# Altium project PCB_Project.PrjPcb
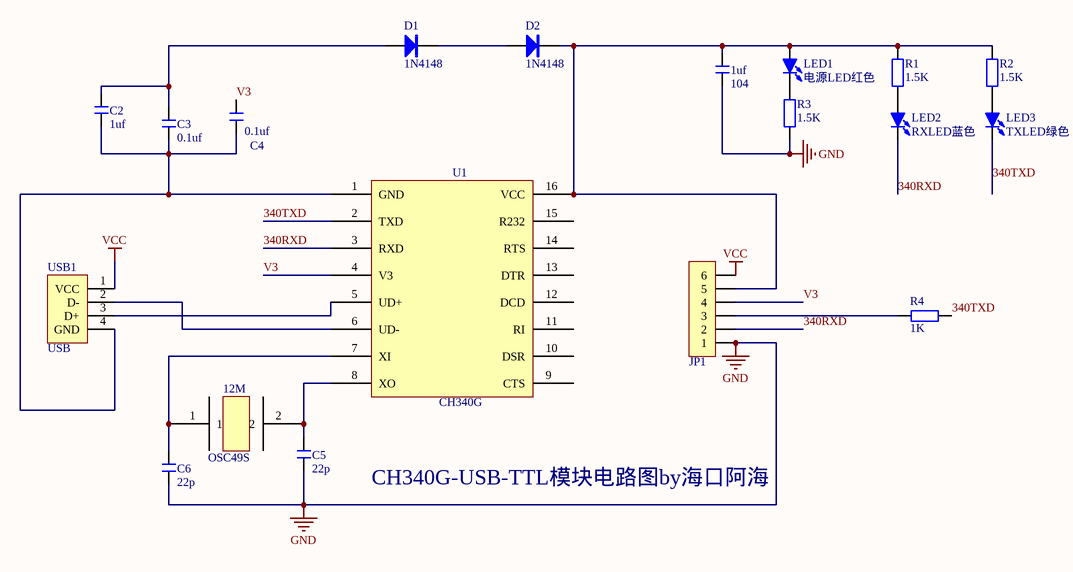
[diagram p0: Sheet1.SchDoc]
1 sheet, 19 parts. Net scope: global (net labels, ports and power ports of the same name join across sheets).
Board file: PCB1.PcbDoc

## Sheet Sheet1.SchDoc
size A4; SheetNumber: 1; SheetTotal: 1

### Parts
1uf  104  [C 0603_L]
12M  OSC49S  [OSC HC-49S]
C2  1uf  [C 0603_L]
C3  0.1uf  [C 0603_L]
C4  0.1uf  [C 0603_L]
C5  22p  [C 0603_L]
C6  22p  [C 0603_L]
D1  1N4148  [MINI_MELF (LL34)]
D2  1N4148  [MINI_MELF (LL34)]
JP1  HDR-1X6  [HDR2.54-LI-6P]  (value not drawn)
LED1  电源LED红色  [LED 0603R]
LED2  RXLED蓝色  [LED 0603B]
LED3  TXLED绿色  [LED 0603G]
R1  1.5K  [R 0603_L]
R2  1.5K  [R 0603_L]
R3  1.5K  [R 0603_L]
R4  1K  [R 0603_L]
U1  CH340G  [SOP16]
USB1  USB  [USB_A/P_A]

### Nets
GND: 1uf.2 C5.1 C6.1 JP1.1 R3.1
VCC: JP1.6 USB1.1(VCC)
340RXD: JP1.2 LED2.2(K) U1.3(RXD)
340TXD: LED3.2(K) R4.2 U1.2(TXD)
V3: C4.2 JP1.4 U1.4(V3)
Net1uf_1: 1uf.1 D2.2(K) JP1.5 LED1.1(A) R1.2 R2.2 U1.16(VCC)
Net12M_1: 12M.1 C6.2 U1.7(XI)
Net12M_2: 12M.2 C5.2 U1.8(XO)
NetC2_1: C2.1 C3.1 C4.1 U1.1(GND) USB1.4(GND)
NetC2_2: C2.2 C3.2 D1.1(A)
NetD1_2: D1.2(K) D2.1(A)
NetJP1_3: JP1.3 R4.1
NetLED1_2: LED1.2(K) R3.2
NetLED2_1: LED2.1(A) R1.1
NetLED3_1: LED3.1(A) R2.1
NetU1_5: U1.5(UD+) USB1.3(D+)
NetU1_6: U1.6(UD-) USB1.2(D-)

Not connected (* = marked no-connect by the designer): U1 9(CTS) 10(DSR) 11(RI) 12(DCD) 13(DTR) 14(RTS) 15(R232)

### Notes on the sheet
- CH340G-USB-TTL模块电路图by海口阿海

### Library data of the parts
1uf C2-C6 = C: 贴片电容; BOM名称: 无极性贴片电容; 淘宝ID: 封装库来自淘宝 ID：黄晶宝石; 联系售后，技术支持: https://shop463601444.taobao.com; 唯一出售店铺网址: https://shop463601444.taobao.com
12M = OSC49S: 晶振49S
D1 D2 = 1N4148: 开关二极管; BOM名称: 高速开关二极管; 淘宝ID: 封装库来自淘宝 ID：黄晶宝石; 欢迎光临: https://shop463601444.taobao.com
JP1 = Header 6: 6P接插件; 版权归属: 封装库来自淘宝 ID：黄晶宝石; BOM名称: 6P接插件; 学习资源: https://shop463601444.taobao.com
LED1-LED3 = LED-SMD: 贴片LED; 版权归属: 封装库来自淘宝 ID：黄晶宝石; BOM名称: 贴片LED; 学习资源: https://shop463601444.taobao.com
R1-R4 = R: 贴片电阻; 版权归属: 来自淘宝 ID：黄晶宝石; 封装库来自淘宝卖家 ID：黄晶宝石: 其他店铺购入均为盗版，不享受售后技术支持服务，请立即申请退款; BOM名称: 贴片电阻; 联系售后: https://shop463601444.taobao.com
U1 = CH340G: USB总线转接芯片
USB1 = USB-A/P: USB-A型公接口; 版权归属: 封装库来自淘宝卖家 ID：黄晶宝石; BOM名称: USB-A型公接口; 学习资源: https://shop463601444.taobao.com